# Altium schematic sheet mcu.SchDoc
size A4
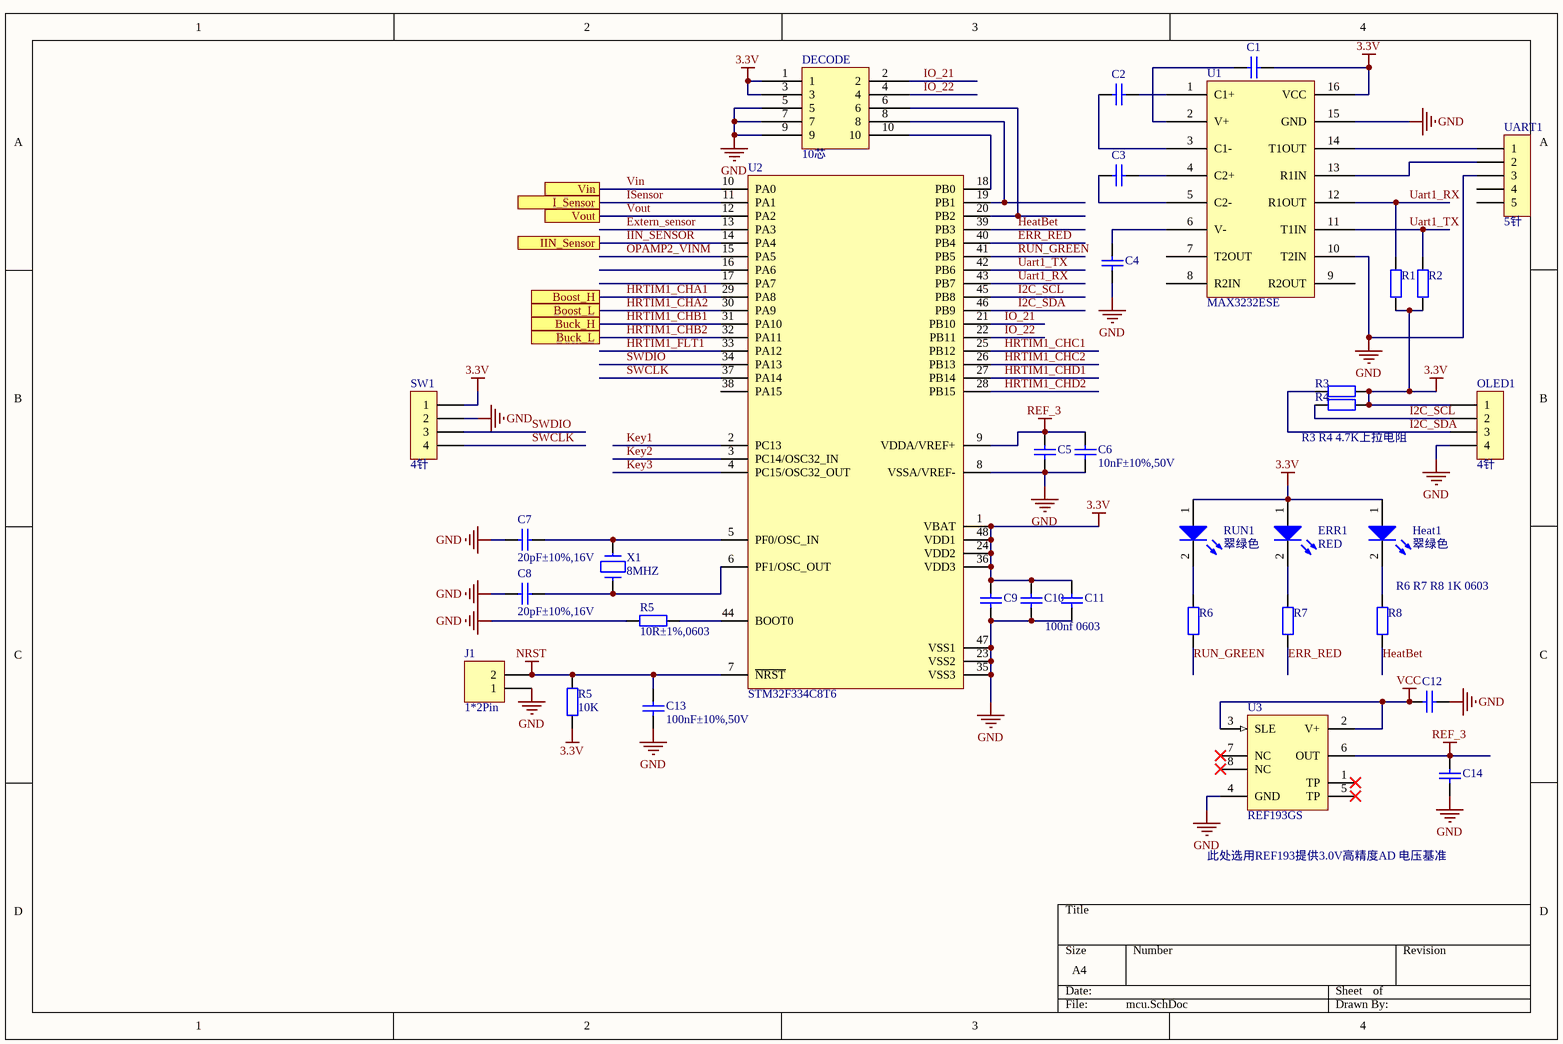
[diagram p0: mcu.SchDoc]

## Parts
(Parts that share a designator on the sheet are numbered #1, #2 ... from top to bottom, then left to right.)
C1  (no value)  [0603]
C2  (no value)  [0603]
C3  (no value)  [0603]
C4  (no value)  [0603]
C5  (no value)  [0603]
C6  10nF±10%,50V  [0603]
C7  20pF±10%,16V  [0603]
C8  20pF±10%,16V  [0603]
C9  (no value)  [0603]
C10  (no value)  [0603]
C11  (no value)  [0603]
C12  (no value)  [0603]
C13  100nF±10%,50V  [0603]
C14  (no value)  [0603]
DECODE  10芯  [IDC-10]
ERR1  RED  [0805LED]
Heat1  翠绿色  [0805LED]
J1  1*2Pin  [HDR1X2]
OLED1  4针  [SIP-4]
R1  (no value)  [0603]
R2  (no value)  [0603]
R3  (no value)  [0603]
R4  (no value)  [0603]
R5#1  10R±1%,0603  [0603]
R5#2  10K  [0603]
R6  (no value)  [0603]
R7  (no value)  [0603]
R8  (no value)  [0603]
RUN1  翠绿色  [0805LED]
SW1  4针  [SIP-4]
U1  MAX3232ESE  [SOP-16]
U2  STM32F334C8T6  [LQFP48_L]
U3  REF193GS  [SO-8]
UART1  5针  [SIP-5-2]
X1  8MHZ  [5032]

## Ports
Boost_H, Boost_L, Buck_H, Buck_L, I_Sensor, IIN_Sensor, Vin, Vout

## Nets
3.3V: C1.1 C9.2 C10.2 C11.2 DECODE.1 DECODE.3 ERR1.1(A) Heat1.1(A) OLED1.1 R1.2 R2.2 R3.1 R4.2 R5#2.1 RUN1.1(A) SW1.1 U1.16(VCC) U2.1(VBAT) U2.24(VDD2) U2.36(VDD3) U2.48(VDD1)
GND: C4.2 C5.1 C6.1 C7.1 C8.1 C9.1 C10.1 C11.1 C12.1 C13.1 C14.1 DECODE.5 DECODE.7 DECODE.9 J1.1 OLED1.4 R5#1.1 SW1.2 U1.10(T2IN) U1.15(GND) U2.8(VSSA/VREF-) U2.23(VSS2) U2.35(VSS3) U2.47(VSS1) U3.4(GND) UART1.3
NRST: C13.2 J1.2 R5#2.2 U2.7(~{NRST})
REF_3: C5.2 C6.2 C14.2 U2.9(VDDA/VREF+) U3.6(OUT)
VCC: C12.2 U3.2(V+) U3.3(SLE)
ERR_RED: R7.1 U2.40(PB4)
Extern_sensor: U2.13(PA3)
HeatBet: R8.1 U2.39(PB3)
HRTIM1_CHA1: U2.29(PA8) ; port Boost_H
HRTIM1_CHA2: U2.30(PA9) ; port Boost_L
HRTIM1_CHB1: U2.31(PA10) ; port Buck_H
HRTIM1_CHB2: U2.32(PA11) ; port Buck_L
HRTIM1_CHC1: U2.25(PB12)
HRTIM1_CHC2: U2.26(PB13)
HRTIM1_CHD1: U2.27(PB14)
HRTIM1_CHD2: U2.28(PB15)
HRTIM1_FLT1: U2.33(PA12)
I2C_SCL: OLED1.2 R4.1 U2.45(PB8)
I2C_SDA: OLED1.3 R3.2 U2.46(PB9)
IIN_SENSOR: U2.14(PA4) ; port IIN_Sensor
IO_21: DECODE.2 U2.21(PB10)
IO_22: DECODE.4 U2.22(PB11)
ISensor: U2.11(PA1) ; port I_Sensor
Key1: U2.2(PC13)
Key2: U2.3(PC14/OSC32_IN)
Key3: U2.4(PC15/OSC32_OUT)
OPAMP2_VINM: U2.15(PA5)
RUN_GREEN: R6.1 U2.41(PB5)
SWCLK: SW1.4 U2.37(PA14)
SWDIO: SW1.3 U2.34(PA13)
Uart1_RX: R1.1 U1.12(R1OUT) U2.43(PB7)
Uart1_TX: R2.1 U1.11(T1IN) U2.42(PB6)
Vin: U2.10(PA0) ; port Vin
Vout: U2.12(PA2) ; port Vout
NetC1_2: C1.2 U1.2(V+)
NetC2_1: C2.1 U1.1(C1+)
NetC2_2: C2.2 U1.3(C1-)
NetC3_1: C3.1 U1.4(C2+)
NetC3_2: C3.2 U1.5(C2-)
NetC4_1: C4.1 U1.6(V-)
NetC7_2: C7.2 U2.5(PF0/OSC_IN) X1.1
NetC8_2: C8.2 U2.6(PF1/OSC_OUT) X1.2
NetDECODE_6: DECODE.6 U2.20(PB2)
NetDECODE_8: DECODE.8 U2.19(PB1)
NetDECODE_10: DECODE.10 U2.18(PB0)
NetERR1_2: ERR1.2(K) R7.2
NetHeat1_2: Heat1.2(K) R8.2
NetR5#1_2: R5#1.2 U2.44(BOOT0)
NetR6_2: R6.2 RUN1.2(K)
NetU1_13: U1.13(R1IN) UART1.2
NetU1_14: U1.14(T1OUT) UART1.1

Not connected (* = marked no-connect by the designer): U1 7(T2OUT) 8(R2IN) 9(R2OUT); U2 16(PA6) 17(PA7) 38(PA15); U3 1(TP)* 5(TP)* 7(NC)* 8(NC)*; UART1 4 5

## Notes on the sheet
- R3 R4 4.7K上拉电阻
- (near R8) R6 R7 R8 1K 0603
- 100nf 0603
- 此处选用REF193提供3.0V高精度AD 电压基准

## Library data of the parts
C1-C5 C9-C14 = 贴片电容,0603,100nF±10%,50V: 贴片电容; 物料代码: 1.02.15.0010406040
C6 = 贴片电容,0603,10nF±10%,50V: 贴片电容; 物料代码: 1.02.15.0010306020
C7 C8 = 贴片电容,0603,20pF±10%,16V: 贴片电容; 物料代码: 1.02.15.0020002000
DECODE = 双列排针母座,10芯,2.54mm: 双列排针母座; 物料代码: 1.06.99.2610000040
ERR1 Heat1 RUN1 = 发光二极管,翠绿色,JLF-0805-1-GC,0805: 发光二极管; 物料代码: 1.03.04.0080510000
J1 = 单列直脚排针,2芯,2.54mm,HDR1X2: 单列直脚排针; 物料代码: 1.06.99.2620000000
OLED1 SW1 = 条形连接器,PH(2.0),4针直针,间距2.00mm,SIP-4: 条形连接器; 物料代码: 1.06.99.2200000010
R1-R4 R5#1 R5#2 R6-R8 = 10R±1%,1/10W,0603: 贴片电阻; 物料代码: 1.01.11.0100010000
U1 = RS232收发器,MAX3232ESE，SOP-16: RS232收发器; 物料代码: 1.04.06.0323200010
U2 = STM32F334Cx
U3 = 电源基准芯片,REF193GS,3V,±10mV,SO-8: 电源基准芯片; 物料代码: 1.04.11.0193000000
UART1 = 条形连接器,PH(2.0),5针直针,间距2.00mm,SIP-5-2: 条形连接器; 物料代码: 1.06.99.2220500000
X1 = XTAL_SMD